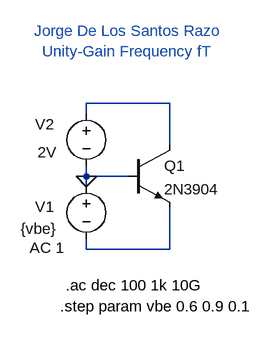
[diagram p0: schematic unity-gain-frequency-fT.asc]
unity-gain-frequency-fT.asc, the LTspice schematic file:
Version 4.1
SHEET 1 880 680
WIRE 288 48 160 48
WIRE 160 64 160 48
WIRE 288 112 288 48
WIRE 160 160 160 144
WIRE 224 160 160 160
WIRE 160 176 160 160
WIRE 160 272 160 256
WIRE 288 272 288 208
WIRE 288 272 160 272
FLAG 160 160 0
SYMBOL npn 224 112 R0
SYMATTR InstName Q1
SYMATTR Value 2N3904
SYMBOL voltage 160 48 R0
WINDOW 0 -79 32 Left 2
WINDOW 3 -75 75 Left 2
WINDOW 123 -99 112 Left 2
WINDOW 39 0 0 Left 0
SYMATTR InstName V2
SYMATTR Value 2V
SYMBOL voltage 160 160 R0
WINDOW 0 -79 47 Left 2
WINDOW 3 -101 81 Left 2
WINDOW 123 -87 110 Left 2
WINDOW 39 0 0 Left 0
SYMATTR InstName V1
SYMATTR Value {vbe}
SYMATTR Value2 AC 1
TEXT 128 328 Left 2 !.ac dec 100 1k 10G
TEXT 120 360 Left 2 !.step param vbe 0.6 0.9 0.1
TEXT 224 -48 Center 2 ;Jorge De Los Santos Razo\nUnity-Gain Frequency fT

The netlist it stands for:
* unity-gain-frequency-fT.asc
Q1 N001 0 N002 0 2N3904
V2 N001 0 2V
V1 0 N002 {vbe} AC 1
.model NPN NPN
.model PNP PNP
.lib standard.bjt
.ac dec 100 1k 10G
.step param vbe 0.6 0.9 0.1
* Jorge De Los Santos Razo
* Unity-Gain Frequency fT
.backanno
.end